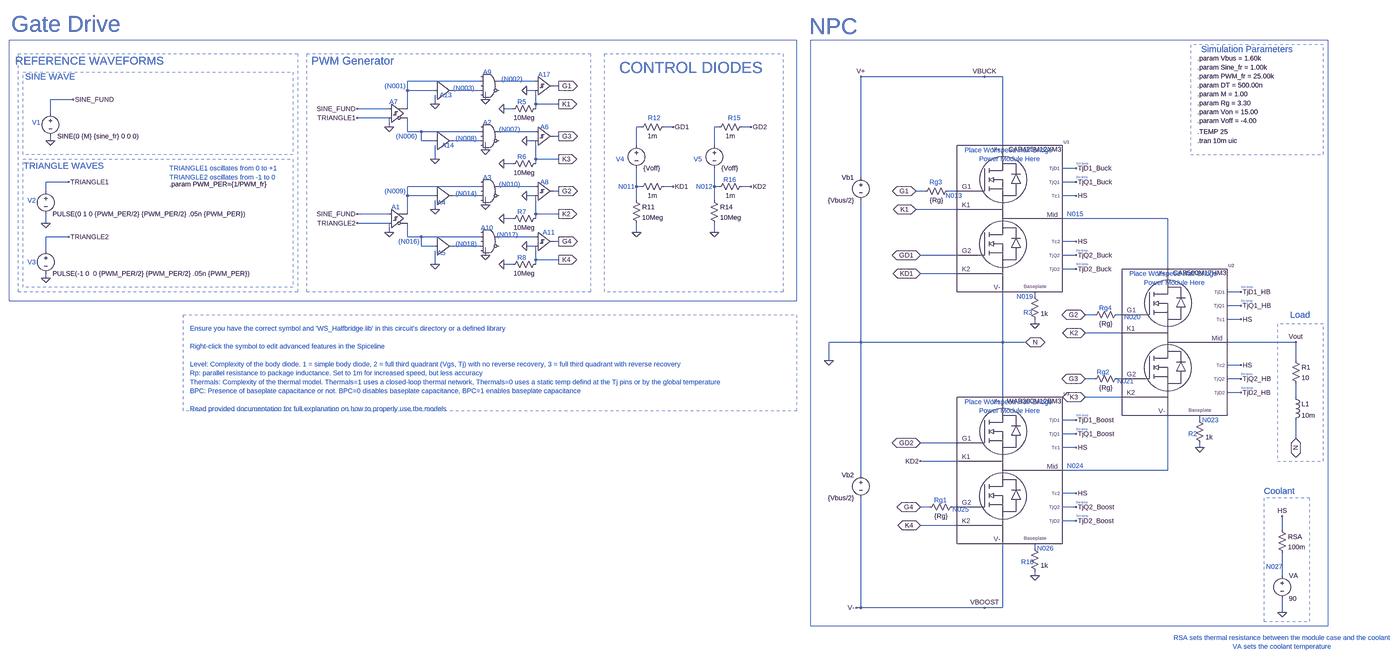
[diagram p0: schematic NPC_Inverter_HB.asc, whole sheet]
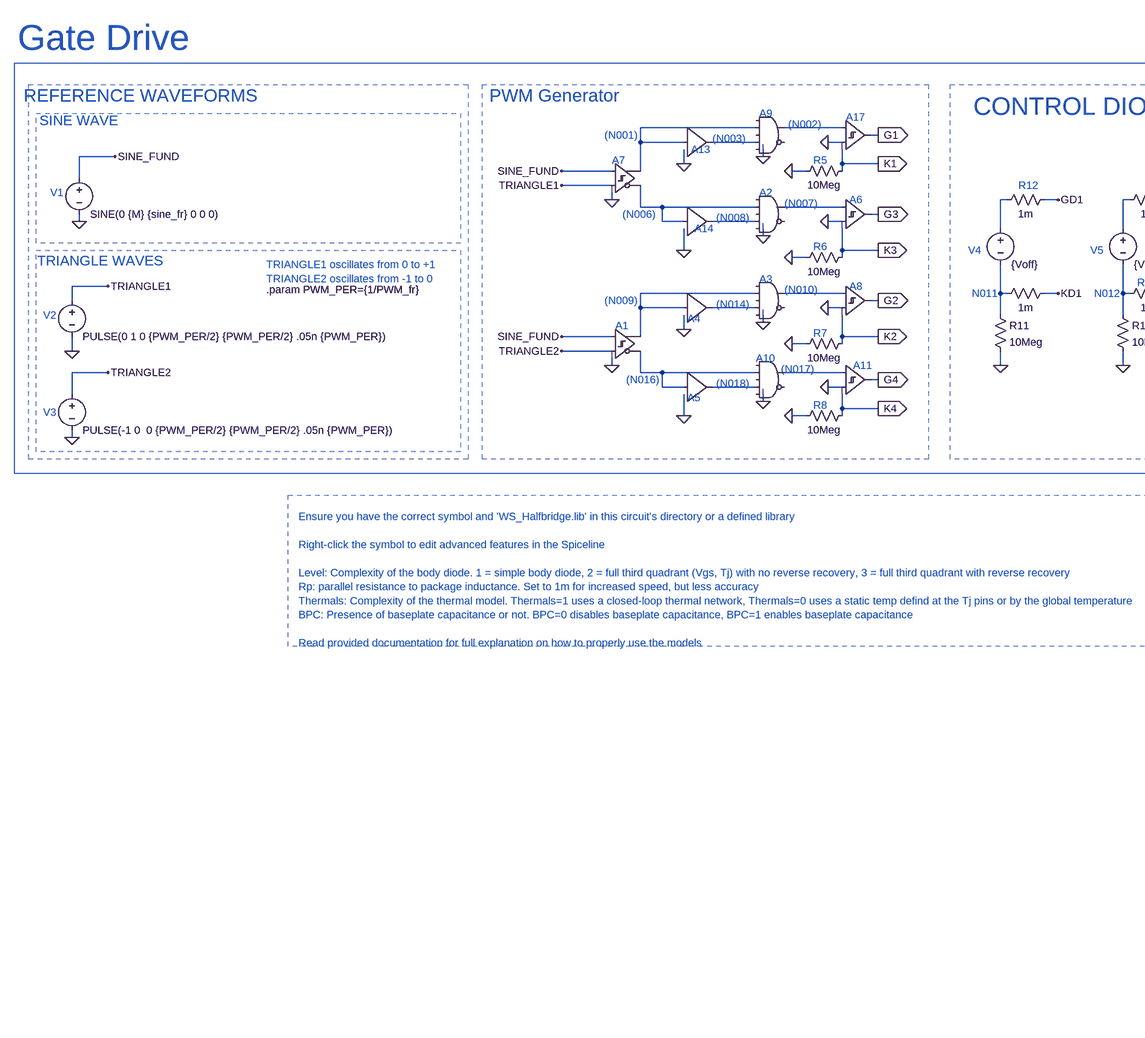
[diagram p1: schematic NPC_Inverter_HB.asc, part, row 1 of 1, column 1 of 2]
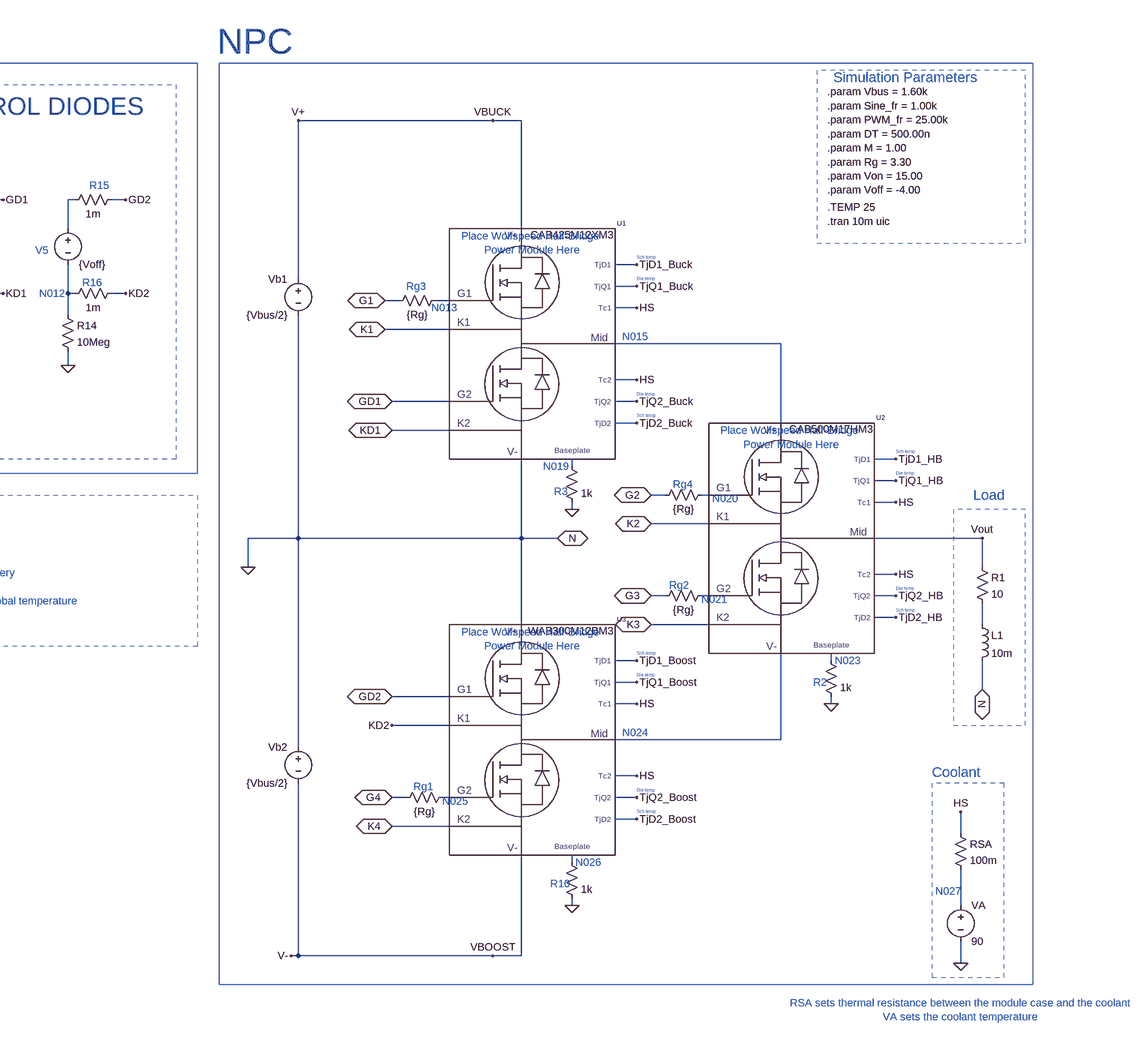
[diagram p2: schematic NPC_Inverter_HB.asc, part, row 1 of 1, column 2 of 2]
NPC_Inverter_HB.asc, the LTspice schematic file:
Version 4
SHEET 1 6464 1400
WIRE 3824 -2720 3392 -2720
WIRE 3888 -2720 3824 -2720
WIRE 2064 -2704 1808 -2704
WIRE 2256 -2704 2128 -2704
WIRE 2336 -2688 2320 -2688
WIRE 1808 -2672 1808 -2704
WIRE 1904 -2672 1808 -2672
WIRE 2064 -2672 1968 -2672
WIRE 2256 -2672 2224 -2672
WIRE 640 -2640 560 -2640
WIRE 2080 -2640 2080 -2656
WIRE 1904 -2624 1904 -2656
WIRE 2256 -2624 2256 -2656
WIRE 2336 -2624 2256 -2624
WIRE 1744 -2608 1632 -2608
WIRE 1808 -2608 1808 -2672
WIRE 2176 -2608 2144 -2608
WIRE 2256 -2608 2256 -2624
WIRE 560 -2592 560 -2640
WIRE 1744 -2576 1632 -2576
WIRE 1744 -2544 1744 -2560
WIRE 2624 -2544 2608 -2544
WIRE 2736 -2544 2704 -2544
WIRE 2896 -2544 2880 -2544
WIRE 3008 -2544 2976 -2544
WIRE 1808 -2528 1808 -2576
WIRE 1856 -2528 1808 -2528
WIRE 2064 -2528 1856 -2528
WIRE 2256 -2528 2128 -2528
WIRE 2336 -2512 2320 -2512
WIRE 560 -2496 560 -2512
WIRE 1856 -2496 1856 -2528
WIRE 1904 -2496 1856 -2496
WIRE 2064 -2496 1968 -2496
WIRE 2256 -2496 2224 -2496
WIRE 2608 -2480 2608 -2544
WIRE 2880 -2480 2880 -2544
WIRE 3888 -2480 3888 -2720
WIRE 2080 -2464 2080 -2480
WIRE 1904 -2432 1904 -2480
WIRE 2256 -2432 2256 -2480
WIRE 2336 -2432 2256 -2432
WIRE 2176 -2416 2144 -2416
WIRE 2256 -2416 2256 -2432
WIRE 4144 -2400 4096 -2400
WIRE 3392 -2368 3392 -2720
WIRE 624 -2352 544 -2352
WIRE 4144 -2352 4096 -2352
WIRE 2064 -2336 1808 -2336
WIRE 2256 -2336 2128 -2336
WIRE 2608 -2336 2608 -2400
WIRE 2624 -2336 2608 -2336
WIRE 2736 -2336 2704 -2336
WIRE 2880 -2336 2880 -2400
WIRE 2896 -2336 2880 -2336
WIRE 3008 -2336 2976 -2336
WIRE 544 -2320 544 -2352
WIRE 2336 -2320 2320 -2320
WIRE 3616 -2320 3584 -2320
WIRE 3728 -2320 3696 -2320
WIRE 1808 -2304 1808 -2336
WIRE 1904 -2304 1808 -2304
WIRE 2064 -2304 1968 -2304
WIRE 2256 -2304 2224 -2304
WIRE 4144 -2304 4096 -2304
WIRE 2608 -2288 2608 -2336
WIRE 2880 -2288 2880 -2336
WIRE 2080 -2272 2080 -2288
WIRE 1904 -2256 1904 -2288
WIRE 3728 -2256 3584 -2256
WIRE 1744 -2240 1632 -2240
WIRE 1808 -2240 1808 -2304
WIRE 2256 -2240 2256 -2288
WIRE 2336 -2240 2256 -2240
WIRE 2176 -2224 2144 -2224
WIRE 2256 -2224 2256 -2240
WIRE 4464 -2224 4096 -2224
WIRE 544 -2208 544 -2240
WIRE 1744 -2208 1632 -2208
WIRE 1744 -2176 1744 -2192
WIRE 2608 -2176 2608 -2208
WIRE 2880 -2176 2880 -2208
WIRE 624 -2160 544 -2160
WIRE 1808 -2160 1808 -2208
WIRE 1856 -2160 1808 -2160
WIRE 2064 -2160 1856 -2160
WIRE 2256 -2160 2128 -2160
WIRE 2336 -2144 2320 -2144
WIRE 4144 -2144 4096 -2144
WIRE 1856 -2128 1856 -2160
WIRE 1904 -2128 1856 -2128
WIRE 2064 -2128 1968 -2128
WIRE 2256 -2128 2224 -2128
WIRE 544 -2112 544 -2160
WIRE 2080 -2096 2080 -2112
WIRE 3728 -2096 3600 -2096
WIRE 4144 -2096 4096 -2096
WIRE 2256 -2080 2256 -2112
WIRE 2336 -2080 2256 -2080
WIRE 1904 -2064 1904 -2112
WIRE 2176 -2064 2144 -2064
WIRE 2256 -2064 2256 -2080
WIRE 4144 -2048 4096 -2048
WIRE 4464 -2048 4464 -2224
WIRE 3728 -2032 3600 -2032
WIRE 544 -2016 544 -2032
WIRE 4720 -1968 4672 -1968
WIRE 4000 -1952 4000 -1968
WIRE 4720 -1920 4672 -1920
WIRE 4208 -1888 4176 -1888
WIRE 4304 -1888 4288 -1888
WIRE 4720 -1872 4672 -1872
WIRE 4000 -1856 4000 -1872
WIRE 4304 -1824 4176 -1824
WIRE 3392 -1792 3392 -2288
WIRE 3392 -1792 3280 -1792
WIRE 3888 -1792 3888 -1968
WIRE 3888 -1792 3392 -1792
WIRE 3968 -1792 3888 -1792
WIRE 4912 -1792 4672 -1792
WIRE 3280 -1728 3280 -1792
WIRE 4912 -1728 4912 -1792
WIRE 4720 -1712 4672 -1712
WIRE 4208 -1664 4176 -1664
WIRE 4304 -1664 4288 -1664
WIRE 4720 -1664 4672 -1664
WIRE 4720 -1616 4672 -1616
WIRE 3888 -1600 3888 -1792
WIRE 4304 -1600 4176 -1600
WIRE 4912 -1600 4912 -1648
WIRE 4144 -1520 4096 -1520
WIRE 4576 -1520 4576 -1536
WIRE 4144 -1472 4096 -1472
WIRE 4912 -1456 4912 -1520
WIRE 3728 -1440 3600 -1440
WIRE 4144 -1424 4096 -1424
WIRE 4576 -1424 4576 -1440
WIRE 3728 -1376 3600 -1376
WIRE 4464 -1344 4464 -1536
WIRE 4464 -1344 4096 -1344
WIRE 3392 -1328 3392 -1792
WIRE 4144 -1264 4096 -1264
WIRE 3632 -1216 3600 -1216
WIRE 3728 -1216 3712 -1216
WIRE 4144 -1216 4096 -1216
WIRE 4144 -1168 4096 -1168
WIRE 3728 -1152 3600 -1152
WIRE 4864 -1136 4864 -1184
WIRE 4000 -1072 4000 -1088
WIRE 4000 -976 4000 -992
WIRE 4864 -976 4864 -1056
WIRE 3392 -864 3392 -1248
WIRE 3392 -864 3376 -864
WIRE 3824 -864 3392 -864
WIRE 3888 -864 3888 -1088
WIRE 3888 -864 3824 -864
WIRE 4864 -848 4864 -896
FLAG 3600 -2096 GD1
IOPIN 3600 -2096 BiDir
FLAG 3584 -2320 G1
IOPIN 3584 -2320 BiDir
FLAG 3600 -1440 GD2
IOPIN 3600 -1440 BiDir
FLAG 3600 -1216 G4
IOPIN 3600 -1216 BiDir
FLAG 4176 -1888 G2
IOPIN 4176 -1888 BiDir
FLAG 4176 -1664 G3
IOPIN 4176 -1664 BiDir
FLAG 560 -2496 0
FLAG 640 -2640 SINE_FUND
FLAG 544 -2208 0
FLAG 624 -2352 TRIANGLE1
FLAG 624 -2160 TRIANGLE2
FLAG 544 -2016 0
FLAG 2608 -2176 0
FLAG 2736 -2544 GD1
FLAG 2736 -2336 KD1
FLAG 2880 -2176 0
FLAG 3008 -2544 GD2
FLAG 3008 -2336 KD2
FLAG 3968 -1792 N
IOPIN 3968 -1792 BiDir
FLAG 3280 -1728 0
FLAG 4912 -1456 N
IOPIN 4912 -1456 BiDir
FLAG 3392 -2720 V+
FLAG 3376 -864 V-
FLAG 3824 -2720 VBUCK
FLAG 3824 -864 VBOOST
FLAG 4912 -1792 Vout
FLAG 3600 -2032 KD1
IOPIN 3600 -2032 BiDir
FLAG 3584 -2256 K1
IOPIN 3584 -2256 BiDir
FLAG 3600 -1376 KD2
FLAG 3600 -1152 K4
IOPIN 3600 -1152 BiDir
FLAG 4176 -1824 K2
IOPIN 4176 -1824 BiDir
FLAG 4176 -1600 K3
IOPIN 4176 -1600 BiDir
FLAG 4144 -2352 TjQ1_Buck
FLAG 4144 -2096 TjQ2_Buck
FLAG 4720 -1920 TjQ1_HB
FLAG 4720 -1664 TjQ2_HB
FLAG 4144 -1472 TjQ1_Boost
FLAG 4144 -1216 TjQ2_Boost
FLAG 1744 -2544 0
FLAG 2080 -2640 0
FLAG 2080 -2464 0
FLAG 2336 -2688 G1
IOPIN 2336 -2688 Out
FLAG 2336 -2144 G4
IOPIN 2336 -2144 Out
FLAG 2336 -2512 G3
IOPIN 2336 -2512 Out
FLAG 2336 -2320 G2
IOPIN 2336 -2320 Out
FLAG 2336 -2240 K2
IOPIN 2336 -2240 Out
FLAG 2336 -2432 K3
IOPIN 2336 -2432 Out
FLAG 2336 -2624 K1
IOPIN 2336 -2624 Out
FLAG 2336 -2080 K4
IOPIN 2336 -2080 Out
FLAG 1904 -2432 0
FLAG 2224 -2672 0
FLAG 2224 -2496 0
FLAG 2224 -2304 0
FLAG 2224 -2128 0
FLAG 1632 -2608 SINE_FUND
FLAG 1632 -2576 TRIANGLE1
FLAG 1904 -2624 0
FLAG 1744 -2176 0
FLAG 2080 -2272 0
FLAG 2080 -2096 0
FLAG 1904 -2064 0
FLAG 1632 -2240 SINE_FUND
FLAG 1632 -2208 TRIANGLE2
FLAG 1904 -2256 0
FLAG 2144 -2608 0
FLAG 2144 -2416 0
FLAG 2144 -2224 0
FLAG 2144 -2064 0
FLAG 4864 -1184 HS
FLAG 4864 -848 0
FLAG 4144 -1264 HS
FLAG 4144 -1424 HS
FLAG 4144 -2144 HS
FLAG 4144 -2304 HS
FLAG 4720 -1712 HS
FLAG 4720 -1872 HS
FLAG 4720 -1616 TjD2_HB
FLAG 4720 -1968 TjD1_HB
FLAG 4144 -2400 TjD1_Buck
FLAG 4144 -2048 TjD2_Buck
FLAG 4144 -1168 TjD2_Boost
FLAG 4144 -1520 TjD1_Boost
FLAG 4000 -976 0
FLAG 4000 -1856 0
FLAG 4576 -1424 0
SYMBOL res 4896 -1744 R0
SYMATTR InstName R1
SYMATTR Value 10
SYMBOL ind 4896 -1616 R0
SYMATTR InstName L1
SYMATTR Value 10m
SYMBOL voltage 560 -2608 R0
WINDOW 123 0 0 Left 2
WINDOW 39 0 0 Left 2
WINDOW 0 24 16 Invisible 2
SYMATTR InstName V1
SYMATTR Value SINE(0 {M} {sine_fr} 0 0 0)
SYMBOL voltage 544 -2336 R0
WINDOW 123 0 0 Left 2
WINDOW 39 0 0 Left 2
WINDOW 0 24 16 Invisible 2
SYMATTR InstName V2
SYMATTR Value PULSE(0 1 0 {PWM_PER/2} {PWM_PER/2} .05n {PWM_PER})
SYMBOL voltage 544 -2128 R0
WINDOW 123 0 0 Left 2
WINDOW 39 0 0 Left 2
WINDOW 0 24 16 Invisible 2
SYMATTR InstName V3
SYMATTR Value PULSE(-1 0  0 {PWM_PER/2} {PWM_PER/2} .05n {PWM_PER})
SYMBOL res 2592 -2304 R0
SYMATTR InstName R11
SYMATTR Value 10Meg
SYMBOL voltage 2608 -2496 R0
WINDOW 123 0 0 Left 2
WINDOW 39 0 0 Left 2
WINDOW 0 24 16 Invisible 2
SYMATTR InstName V4
SYMATTR Value {Voff}
SYMBOL res 2720 -2560 R90
WINDOW 0 0 56 Invisible 2
WINDOW 3 32 56 VTop 2
SYMATTR InstName R12
SYMATTR Value 1m
SYMBOL res 2720 -2352 R90
WINDOW 0 0 56 Invisible 2
WINDOW 3 32 56 VTop 2
SYMATTR InstName R13
SYMATTR Value 1m
SYMBOL res 2864 -2304 R0
SYMATTR InstName R14
SYMATTR Value 10Meg
SYMBOL voltage 2880 -2496 R0
WINDOW 123 0 0 Left 2
WINDOW 39 0 0 Left 2
WINDOW 0 24 16 Invisible 2
SYMATTR InstName V5
SYMATTR Value {Voff}
SYMBOL res 2992 -2560 R90
WINDOW 0 0 56 Invisible 2
WINDOW 3 32 56 VTop 2
SYMATTR InstName R15
SYMATTR Value 1m
SYMBOL res 2992 -2352 R90
WINDOW 0 0 56 Invisible 2
WINDOW 3 32 56 VTop 2
SYMATTR InstName R16
SYMATTR Value 1m
SYMBOL res 3712 -2336 R90
WINDOW 0 0 56 Invisible 2
WINDOW 3 32 56 VTop 2
SYMATTR InstName Rg3
SYMATTR Value {Rg}
SYMBOL voltage 3392 -2384 M0
WINDOW 123 0 0 Left 2
WINDOW 39 0 0 Left 2
SYMATTR InstName Vb1
SYMATTR Value {Vbus/2}
SYMBOL voltage 3392 -1344 M0
WINDOW 123 0 0 Left 2
WINDOW 39 0 0 Left 2
SYMATTR InstName Vb2
SYMATTR Value {Vbus/2}
SYMBOL res 3728 -1232 R90
WINDOW 0 0 56 Invisible 2
WINDOW 3 32 56 VTop 2
SYMATTR InstName Rg1
SYMATTR Value {Rg}
SYMBOL res 4304 -1680 R90
WINDOW 0 0 56 Invisible 2
WINDOW 3 32 56 VTop 2
SYMATTR InstName Rg2
SYMATTR Value {Rg}
SYMBOL res 4304 -1904 R90
WINDOW 0 0 56 Invisible 2
WINDOW 3 32 56 VTop 2
SYMATTR InstName Rg4
SYMATTR Value {Rg}
SYMBOL diffschmitt 1744 -2656 R0
WINDOW 3 8 120 Invisible 2
WINDOW 0 8 16 Invisible 2
SYMATTR Value tripdt=10n Vt=0
SYMATTR InstName A7
SYMBOL and 2096 -2752 R0
WINDOW 0 16 24 Invisible 2
SYMATTR InstName A9
SYMBOL buf1 1904 -2736 R0
WINDOW 3 8 104 Invisible 2
WINDOW 0 8 32 Invisible 2
SYMATTR Value Td={DT} Trise=10n
SYMATTR InstName A13
SYMBOL buf1 1904 -2560 R0
WINDOW 3 8 104 Invisible 2
WINDOW 0 8 32 Invisible 2
SYMATTR Value Td={DT} Trise=10n
SYMATTR InstName A14
SYMBOL diffschmtbuf 2256 -2752 R0
WINDOW 3 8 120 Invisible 2
WINDOW 0 8 16 Invisible 2
SYMATTR Value Vhigh={Von} Vt=1m tripdt=10n Vlow={Voff}
SYMATTR InstName A17
SYMBOL diffschmitt 1744 -2288 R0
WINDOW 3 8 120 Invisible 2
WINDOW 0 8 16 Invisible 2
SYMATTR Value tripdt=10n Vt=0
SYMATTR InstName A1
SYMBOL buf1 1904 -2368 R0
WINDOW 3 8 104 Invisible 2
WINDOW 0 8 32 Invisible 2
SYMATTR Value Td={DT} Trise=10n
SYMATTR InstName A4
SYMBOL buf1 1904 -2192 R0
WINDOW 3 8 104 Invisible 2
WINDOW 0 8 32 Invisible 2
SYMATTR Value Td={DT} Trise=10n
SYMATTR InstName A5
SYMBOL res 2272 -2624 R90
WINDOW 0 0 56 Invisible 2
WINDOW 3 32 56 VTop 2
SYMATTR InstName R5
SYMATTR Value 10Meg
SYMBOL res 2272 -2432 R90
WINDOW 0 0 56 Invisible 2
WINDOW 3 32 56 VTop 2
SYMATTR InstName R6
SYMATTR Value 10Meg
SYMBOL res 2272 -2240 R90
WINDOW 0 0 56 Invisible 2
WINDOW 3 32 56 VTop 2
SYMATTR InstName R7
SYMATTR Value 10Meg
SYMBOL res 2272 -2080 R90
WINDOW 0 0 56 Invisible 2
WINDOW 3 32 56 VTop 2
SYMATTR InstName R8
SYMATTR Value 10Meg
SYMBOL diffschmtbuf 2256 -2576 R0
WINDOW 3 8 120 Invisible 2
WINDOW 0 8 16 Invisible 2
SYMATTR Value Vhigh={Von} Vt=1m tripdt=10n Vlow={Voff}
SYMATTR InstName A6
SYMBOL diffschmtbuf 2256 -2384 R0
WINDOW 3 8 120 Invisible 2
WINDOW 0 8 16 Invisible 2
SYMATTR Value Vhigh={Von} Vt=1m tripdt=10n Vlow={Voff}
SYMATTR InstName A8
SYMBOL diffschmtbuf 2256 -2208 R0
WINDOW 3 8 120 Invisible 2
WINDOW 0 8 16 Invisible 2
SYMATTR Value Vhigh={Von} Vt=1m tripdt=10n Vlow={Voff}
SYMATTR InstName A11
SYMBOL res 4848 -1152 R0
SYMATTR InstName RSA
SYMATTR Value 100m
SYMBOL voltage 4864 -992 R0
SYMATTR InstName VA
SYMATTR Value 90
SYMBOL and 2096 -2576 R0
WINDOW 0 16 24 Invisible 2
SYMATTR InstName A2
SYMBOL and 2096 -2384 R0
WINDOW 0 16 24 Invisible 2
SYMATTR InstName A3
SYMBOL and 2096 -2208 R0
WINDOW 0 16 24 Invisible 2
SYMATTR InstName A10
SYMBOL res 3984 -1088 R0
WINDOW 0 36 40 Invisible 2
SYMATTR InstName R10
SYMATTR Value 1k
SYMBOL res 3984 -1968 R0
WINDOW 0 36 40 Invisible 2
SYMATTR InstName R3
SYMATTR Value 1k
SYMBOL res 4560 -1536 R0
WINDOW 0 36 40 Invisible 2
SYMATTR InstName R2
SYMATTR Value 1k
SYMBOL CAB425M12XM3_LTspice 3744 -1968 R0
SYMATTR InstName U1
SYMBOL CAB500M17HM3_LTspice 4320 -1536 R0
SYMATTR InstName U2
SYMBOL WAB300M12BM3_LTspice 3744 -1088 R0
SYMATTR InstName U3
TEXT 976 -2344 Left 2 !.param PWM_PER={1/PWM_fr}
TEXT 4928 -1888 Center 3 ;Load
TEXT 976 -2400 Left 2 ;TRIANGLE1 oscillates from 0 to +1\nTRIANGLE2 oscillates from -1 to 0
TEXT 696 -2776 Center 4 ;REFERENCE WAVEFORMS
TEXT 560 -2720 Center 3 ;SINE WAVE
TEXT 608 -2408 Center 3 ;TRIANGLE WAVES
TEXT 2800 -2752 Center 5 ;CONTROL DIODES
TEXT 4744 -2816 Center 3 ;Simulation Parameters
TEXT 4568 -2496 Left 2 !.tran 10m uic
TEXT 616 -2904 Center 6 ;Gate Drive
TEXT 3296 -2896 Center 6 ;NPC
TEXT 4568 -2784 Left 2 !.param Vbus = 1.60k\n.param Sine_fr = 1.00k\n.param PWM_fr = 25.00k\n.param DT = 500.00n\n.param M = 1.00\n.param Rg = 3.30\n.param Von = 15.00\n.param Voff = -4.00
TEXT 4144 -1232 Left 0 ;Die temp
TEXT 4144 -2368 Left 0 ;Die temp
TEXT 4144 -2112 Left 0 ;Die temp
TEXT 4720 -1936 Left 0 ;Die temp
TEXT 4720 -1680 Left 0 ;Die temp
TEXT 4144 -1488 Left 0 ;Die temp
TEXT 4568 -2528 Left 2 !.TEMP 25
TEXT 1472 -2776 Left 4 ;PWM Generator
TEXT 4856 -1272 Center 3 ;Coolant
TEXT 4720 -1632 Left 0 ;Sch temp
TEXT 4720 -1984 Left 0 ;Sch temp
TEXT 4144 -2416 Left 0 ;Sch temp
TEXT 4144 -2064 Left 0 ;Sch temp
TEXT 4144 -1184 Left 0 ;Sch temp
TEXT 4144 -1536 Left 0 ;Sch temp
TEXT 3912 -2448 Center 2 ;Place Wolfspeed Half-Bridge \nPower Module Here
TEXT 3912 -1568 Center 2 ;Place Wolfspeed Half-Bridge \nPower Module Here
TEXT 4488 -2016 Center 2 ;Place Wolfspeed Half-Bridge \nPower Module Here
TEXT 1048 -1840 Left 2 ;Ensure you have the correct symbol and 'WS_Halfbridge.lib' in this circuit's directory or a defined library\n \nRight-click the symbol to edit advanced features in the Spiceline\n \nLevel: Complexity of the body diode. 1 = simple body diode, 2 = full third quadrant (Vgs, Tj) with no reverse recovery, 3 = full third quadrant with reverse recovery\nRp: parallel resistance to package inductance. Set to 1m for increased speed, but less accuracy\nThermals: Complexity of the thermal model. Thermals=1 uses a closed-loop thermal network, Thermals=0 uses a static temp defind at the Tj pins or by the global temperature\nBPC: Presence of baseplate capacitance or not. BPC=0 disables baseplate capacitance, BPC=1 enables baseplate capacitance\n \nRead provided documentation for full explanation on how to properly use the models
TEXT 4864 -744 Center 2 ;RSA sets thermal resistance between the module case and the coolant\nVA sets the coolant temperature
TEXT 1744 -2632 Left 2 ;A7
TEXT 1920 -2656 Left 2 ;A13
TEXT 1968 -2680 Left 2 ;(N003)
TEXT 1728 -2688 Left 2 ;(N001)
TEXT 1928 -2480 Left 2 ;A14
TEXT 1752 -2264 Left 2 ;A1
TEXT 1912 -2280 Left 2 ;A4
TEXT 1912 -2104 Left 2 ;A5
TEXT 2072 -2736 Left 2 ;A9
TEXT 2072 -2560 Left 2 ;A2
TEXT 2072 -2368 Left 2 ;A3
TEXT 2064 -2192 Left 2 ;A10
TEXT 2264 -2728 Left 2 ;A17
TEXT 2272 -2544 Left 2 ;A6
TEXT 2272 -2352 Left 2 ;A8
TEXT 2280 -2176 Left 2 ;A11
TEXT 2192 -2632 Left 2 ;R5
TEXT 2192 -2440 Left 2 ;R6
TEXT 2192 -2248 Left 2 ;R7
TEXT 2192 -2088 Left 2 ;R8
TEXT 1768 -2512 Left 2 ;(N006)
TEXT 1728 -2320 Left 2 ;(N009)
TEXT 1776 -2144 Left 2 ;(N016)
TEXT 1976 -2504 Left 2 ;(N008)
TEXT 1976 -2312 Left 2 ;(N014)
TEXT 1976 -2136 Left 2 ;(N018)
TEXT 2136 -2712 Left 2 ;(N002)
TEXT 2128 -2536 Left 2 ;(N007)
TEXT 2128 -2344 Left 2 ;(N010)
TEXT 2120 -2168 Left 2 ;(N017)
TEXT 2648 -2576 Left 2 ;R12
TEXT 2536 -2432 Left 2 ;V4
TEXT 2544 -2336 Left 2 ;N011
TEXT 2928 -2576 Left 2 ;R15
TEXT 2808 -2432 Left 2 ;V5
TEXT 2816 -2336 Left 2 ;N012
TEXT 2912 -2360 Left 2 ;R16
TEXT 496 -2560 Left 2 ;V1
TEXT 480 -2288 Left 2 ;V2
TEXT 480 -2072 Left 2 ;V3
TEXT 3632 -2352 Left 2 ;Rg3
TEXT 3936 -1952 Left 2 ;N019
TEXT 3960 -1896 Left 2 ;R3
TEXT 3688 -2304 Left 2 ;N013
TEXT 4224 -1912 Left 2 ;Rg4
TEXT 4312 -1880 Left 2 ;N020
TEXT 4216 -1688 Left 2 ;Rg2
TEXT 4288 -1656 Left 2 ;N021
TEXT 3648 -1240 Left 2 ;Rg1
TEXT 3712 -1208 Left 2 ;N025
TEXT 3952 -1024 Left 2 ;R10
TEXT 4008 -1072 Left 2 ;N026
TEXT 4536 -1472 Left 2 ;R2
TEXT 4584 -1520 Left 2 ;N023
TEXT 4808 -1008 Left 2 ;N027
TEXT 4112 -2240 Left 2 ;N015
TEXT 4112 -1360 Left 2 ;N024
RECTANGLE Normal 5024 -2848 3216 -800
RECTANGLE Normal 5008 -1856 4848 -1376 1
RECTANGLE Normal 1408 -1984 464 -2432 2
RECTANGLE Normal 1408 -2448 464 -2736 2
RECTANGLE Normal 5008 -2832 4544 -2448 2
RECTANGLE Normal 1424 -1968 448 -2800 1
RECTANGLE Normal 3120 -1968 2496 -2800 1
RECTANGLE Normal 3168 -2848 416 -1936
RECTANGLE Normal 2448 -1968 1456 -2800 1
RECTANGLE Normal 4960 -1248 4800 -816 1
RECTANGLE Normal 4096 -1968 3728 -2480
RECTANGLE Normal 4096 -1088 3728 -1600
RECTANGLE Normal 4672 -1536 4304 -2048
RECTANGLE Normal 3168 -1552 1024 -1888 2

The netlist it stands for:
* NPC_Inverter_HB.asc
R1 Vout N022 10
L1 N022 0 10m
V1 SINE_FUND 0 SINE(0 {M} {sine_fr} 0 0 0)
V2 TRIANGLE1 0 PULSE(0 1 0 {PWM_PER/2} {PWM_PER/2} .05n {PWM_PER})
V3 TRIANGLE2 0 PULSE(-1 0  0 {PWM_PER/2} {PWM_PER/2} .05n {PWM_PER})
R11 N011 0 10Meg
V4 N004 N011 {Voff}
R12 GD1 N004 1m
R13 KD1 N011 1m
R14 N012 0 10Meg
V5 N005 N012 {Voff}
R15 GD2 N005 1m
R16 KD2 N012 1m
Rg3 N013 G1 {Rg}
Vb1 VBUCK 0 {Vbus/2}
Vb2 0 VBOOST {Vbus/2}
Rg1 N025 G4 {Rg}
Rg2 N021 G3 {Rg}
Rg4 N020 G2 {Rg}
A7 SINE_FUND TRIANGLE1 0 0 0 N006 N001 0 SCHMITT tripdt=10n Vt=0
A9 0 N001 0 N003 0 0 N002 0 AND
A13 N001 0 0 0 0 0 N003 0 BUF Td={DT} Trise=10n
A14 N006 0 0 0 0 0 N008 0 BUF Td={DT} Trise=10n
A17 N002 0 K1 K1 K1 K1 G1 K1 SCHMITT Vhigh={Von} Vt=1m tripdt=10n Vlow={Voff}
A1 SINE_FUND TRIANGLE2 0 0 0 N016 N009 0 SCHMITT tripdt=10n Vt=0
A4 N009 0 0 0 0 0 N014 0 BUF Td={DT} Trise=10n
A5 N016 0 0 0 0 0 N018 0 BUF Td={DT} Trise=10n
R5 K1 0 10Meg
R6 K3 0 10Meg
R7 K2 0 10Meg
R8 K4 0 10Meg
A6 N007 0 K3 K3 K3 K3 G3 K3 SCHMITT Vhigh={Von} Vt=1m tripdt=10n Vlow={Voff}
A8 N010 0 K2 K2 K2 K2 G2 K2 SCHMITT Vhigh={Von} Vt=1m tripdt=10n Vlow={Voff}
A11 N017 0 K4 K4 K4 K4 G4 K4 SCHMITT Vhigh={Von} Vt=1m tripdt=10n Vlow={Voff}
RSA HS N027 100m
VA N027 0 90
A2 0 N006 0 N008 0 0 N007 0 AND
A3 0 N009 0 N014 0 0 N010 0 AND
A10 0 N016 0 N018 0 0 N017 0 AND
R10 N026 0 1k
R3 N019 0 1k
R2 N023 0 1k
XU1 VBUCK N015 0 N013 K1 GD1 KD1 HS HS TjQ1_Buck TjQ2_Buck TjD1_Buck TjD2_Buck N019 CAB425M12XM3 Thermals=1 BPC=0 level=3 Rp=100  ; pins V+ Mid V- G1 K1 G2 K2 Tc1 Tc2 TjQ1 TjQ2 TjD1 TjD2 Baseplate
XU2 N015 Vout N024 N020 K2 N021 K3 HS HS TjQ1_HB TjQ2_HB TjD1_HB TjD2_HB N023 CAB500M17HM3 Thermals=1 BPC=0 level=3 Rp=100  ; pins V+ Mid V- G1 K1 G2 K2 Tc1 Tc2 TjQ1 TjQ2 TjD1 TjD2 Baseplate
XU3 0 N024 VBOOST GD2 KD2 N025 K4 HS HS TjQ1_Boost TjQ2_Boost TjD1_Boost TjD2_Boost N026 WAB300M12BM3 Thermals=1 BPC=0 level=3 Rp=100  ; pins V+ Mid V- G1 K1 G2 K2 Tc1 Tc2 TjQ1 TjQ2 TjD1 TjD2 Baseplate
.param PWM_PER={1/PWM_fr}
* Load
* TRIANGLE1 oscillates from 0 to +1
* TRIANGLE2 oscillates from -1 to 0
* REFERENCE WAVEFORMS
* SINE WAVE
* TRIANGLE WAVES
* CONTROL DIODES
* Simulation Parameters
.tran 10m uic
* Gate Drive
* NPC
.param Vbus = 1.60k
.param Sine_fr = 1.00k
.param PWM_fr = 25.00k
.param DT = 500.00n
.param M = 1.00
.param Rg = 3.30
.param Von = 15.00
.param Voff = -4.00
* Die temp
* Die temp
* Die temp
* Die temp
* Die temp
* Die temp
.TEMP 25
* PWM Generator
* Coolant
* Sch temp
* Sch temp
* Sch temp
* Sch temp
* Sch temp
* Sch temp
* Place Wolfspeed Half-Bridge
* Power Module Here
* Place Wolfspeed Half-Bridge
* Power Module Here
* Place Wolfspeed Half-Bridge
* Power Module Here
* Ensure you have the correct symbol and 'WS_Halfbridge.lib' in this circuit's directory or a defined library
* Right-click the symbol to edit advanced features in the Spiceline
* Level: Complexity of the body diode. 1 = simple body diode, 2 = full third quadrant (Vgs, Tj) with no reverse recovery, 3 = full third quadrant with reverse recovery
* Rp: parallel resistance to package inductance. Set to 1m for increased speed, but less accuracy
* Thermals: Complexity of the thermal model. Thermals=1 uses a closed-loop thermal network, Thermals=0 uses a static temp defind at the Tj pins or by the global temperature
* BPC: Presence of baseplate capacitance or not. BPC=0 disables baseplate capacitance, BPC=1 enables baseplate capacitance
* Read provided documentation for full explanation on how to properly use the models
* RSA sets thermal resistance between the module case and the coolant
* VA sets the coolant temperature
* A7
* A13
* (N003)
* (N001)
* A14
* A1
* A4
* A5
* A9
* A2
* A3
* A10
* A17
* A6
* A8
* A11
* R5
* R6
* R7
* R8
* (N006)
* (N009)
* (N016)
* (N008)
* (N014)
* (N018)
* (N002)
* (N007)
* (N010)
* (N017)
* R12
* V4
* N011
* R15
* V5
* N012
* R16
* V1
* V2
* V3
* Rg3
* N019
* R3
* N013
* Rg4
* N020
* Rg2
* N021
* Rg1
* N025
* R10
* N026
* R2
* N023
* N027
* N015
* N024
.lib WS_HalfBridge.lib
.backanno
.end